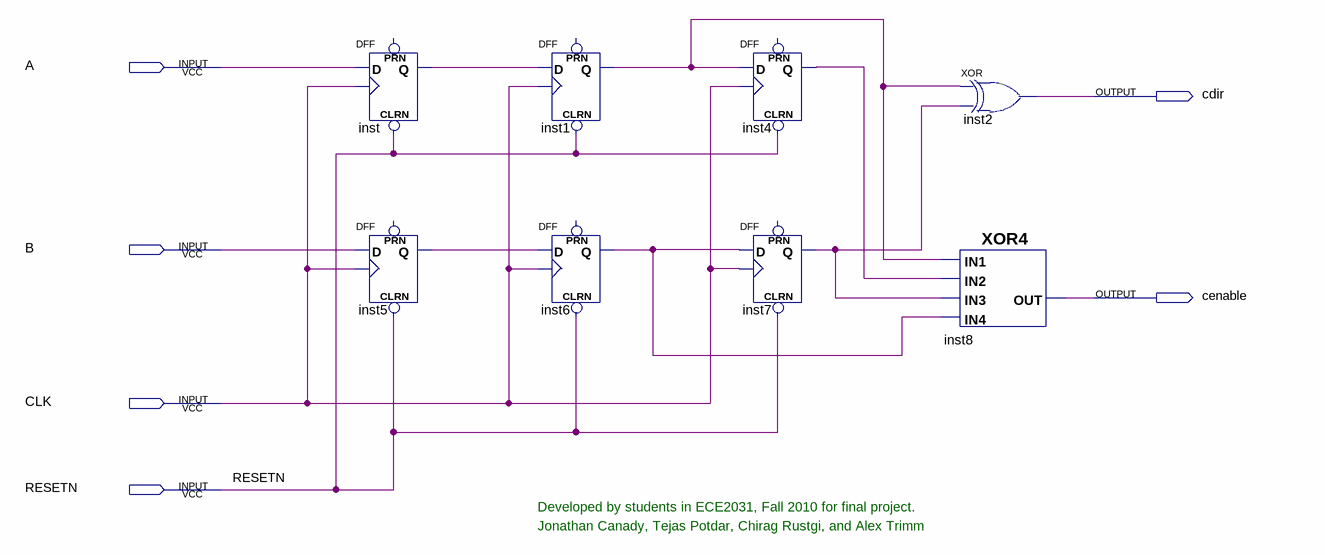
[diagram p0: schematic sheet]
// Quartus schematic quadrature_decode.bdf as structural Verilog: 8 symbols, 6 pins
module quadrature_decode (
  input  A,
  input  B,
  input  CLK,
  input  RESETN,
  output cdir,
  output cenable
);

  wire inst1_q, inst4_q, inst5_q, inst6_q, inst7_q, inst_q;

  DFF inst (.CLRN(RESETN), .CLK(CLK), .D(A), .Q(inst_q));  // open: PRN
  DFF inst5 (.CLRN(RESETN), .CLK(CLK), .D(B), .Q(inst5_q));  // open: PRN
  DFF inst1 (.CLRN(RESETN), .CLK(CLK), .D(inst_q), .Q(inst1_q));  // open: PRN
  DFF inst6 (.CLRN(RESETN), .CLK(CLK), .D(inst5_q), .Q(inst6_q));  // open: PRN
  DFF inst4 (.CLRN(RESETN), .CLK(CLK), .D(inst1_q), .Q(inst4_q));  // open: PRN
  DFF inst7 (.CLRN(RESETN), .CLK(CLK), .D(inst6_q), .Q(inst7_q));  // open: PRN
  xor inst2 (cdir, inst1_q, inst7_q);
  XOR4 inst8 (.IN3(inst7_q), .IN4(inst6_q), .IN2(inst4_q), .IN1(inst1_q), .OUT(cenable));

  // Notes on the sheet:
  //   Developed by students in ECE2031, Fall 2010 for final project.
  //   Jonathan Canady, Tejas Potdar, Chirag Rustgi, and Alex Trimm
endmodule
